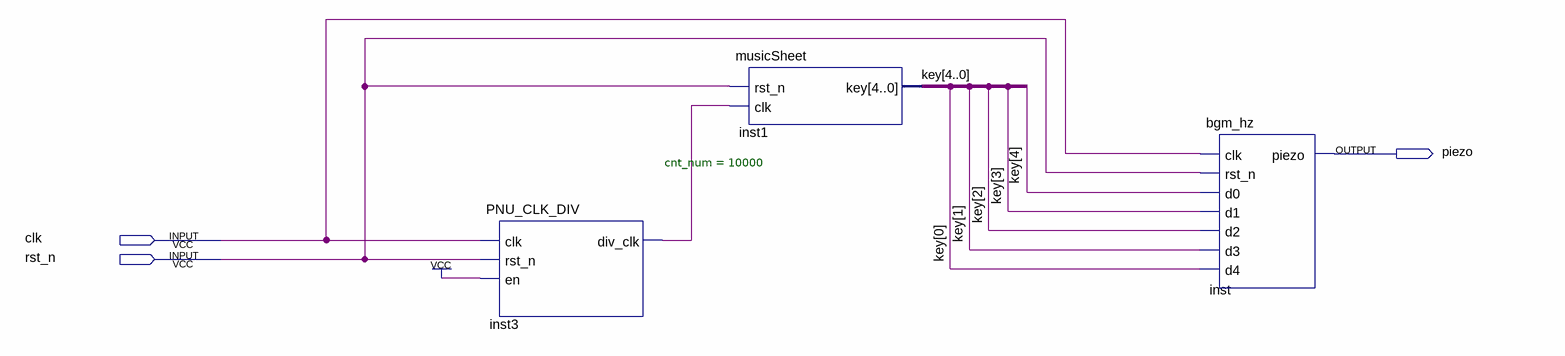
[diagram p0: schematic sheet]
// Quartus schematic piezo.bdf as structural Verilog: 3 symbols, 3 pins
module piezo (
  input  clk,
  input  rst_n,
  output piezo
);

  wire inst3_div_clk;
  wire [4:0] key;

  PNU_CLK_DIV #(.cnt_num(10000)) inst3 (.clk(clk), .rst_n(rst_n), .en(1'b1), .div_clk(inst3_div_clk));
  musicSheet inst1 (.rst_n(rst_n), .clk(inst3_div_clk), .key(key));
  bgm_hz inst (
    .clk(clk), .rst_n(rst_n), .d0(key[4]), .d1(key[3]), .d2(key[2]), .d3(key[1]), .d4(key[0]), .piezo(piezo));
endmodule
